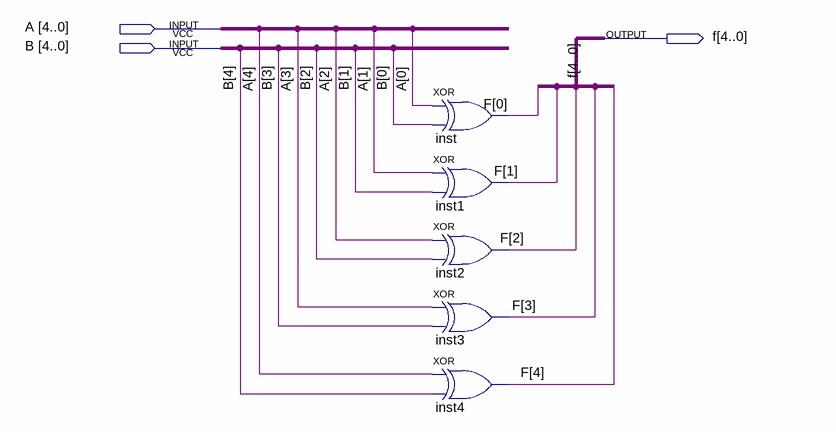
[diagram p0: schematic sheet]
// Quartus schematic xor5bit.bdf as structural Verilog: 5 symbols, 3 pins
module xor5bit (
  input  [4:0] A,
  input  [4:0] B,
  output [4:0] f
);

  xor inst (f[0], A[0], B[0]);
  xor inst1 (f[1], A[1], B[1]);
  xor inst2 (f[2], A[2], B[2]);
  xor inst3 (f[3], A[3], B[3]);
  xor inst4 (f[4], A[4], B[4]);
endmodule
